# EAGLE schematic Max756Breakout (EAGLE 6.3)
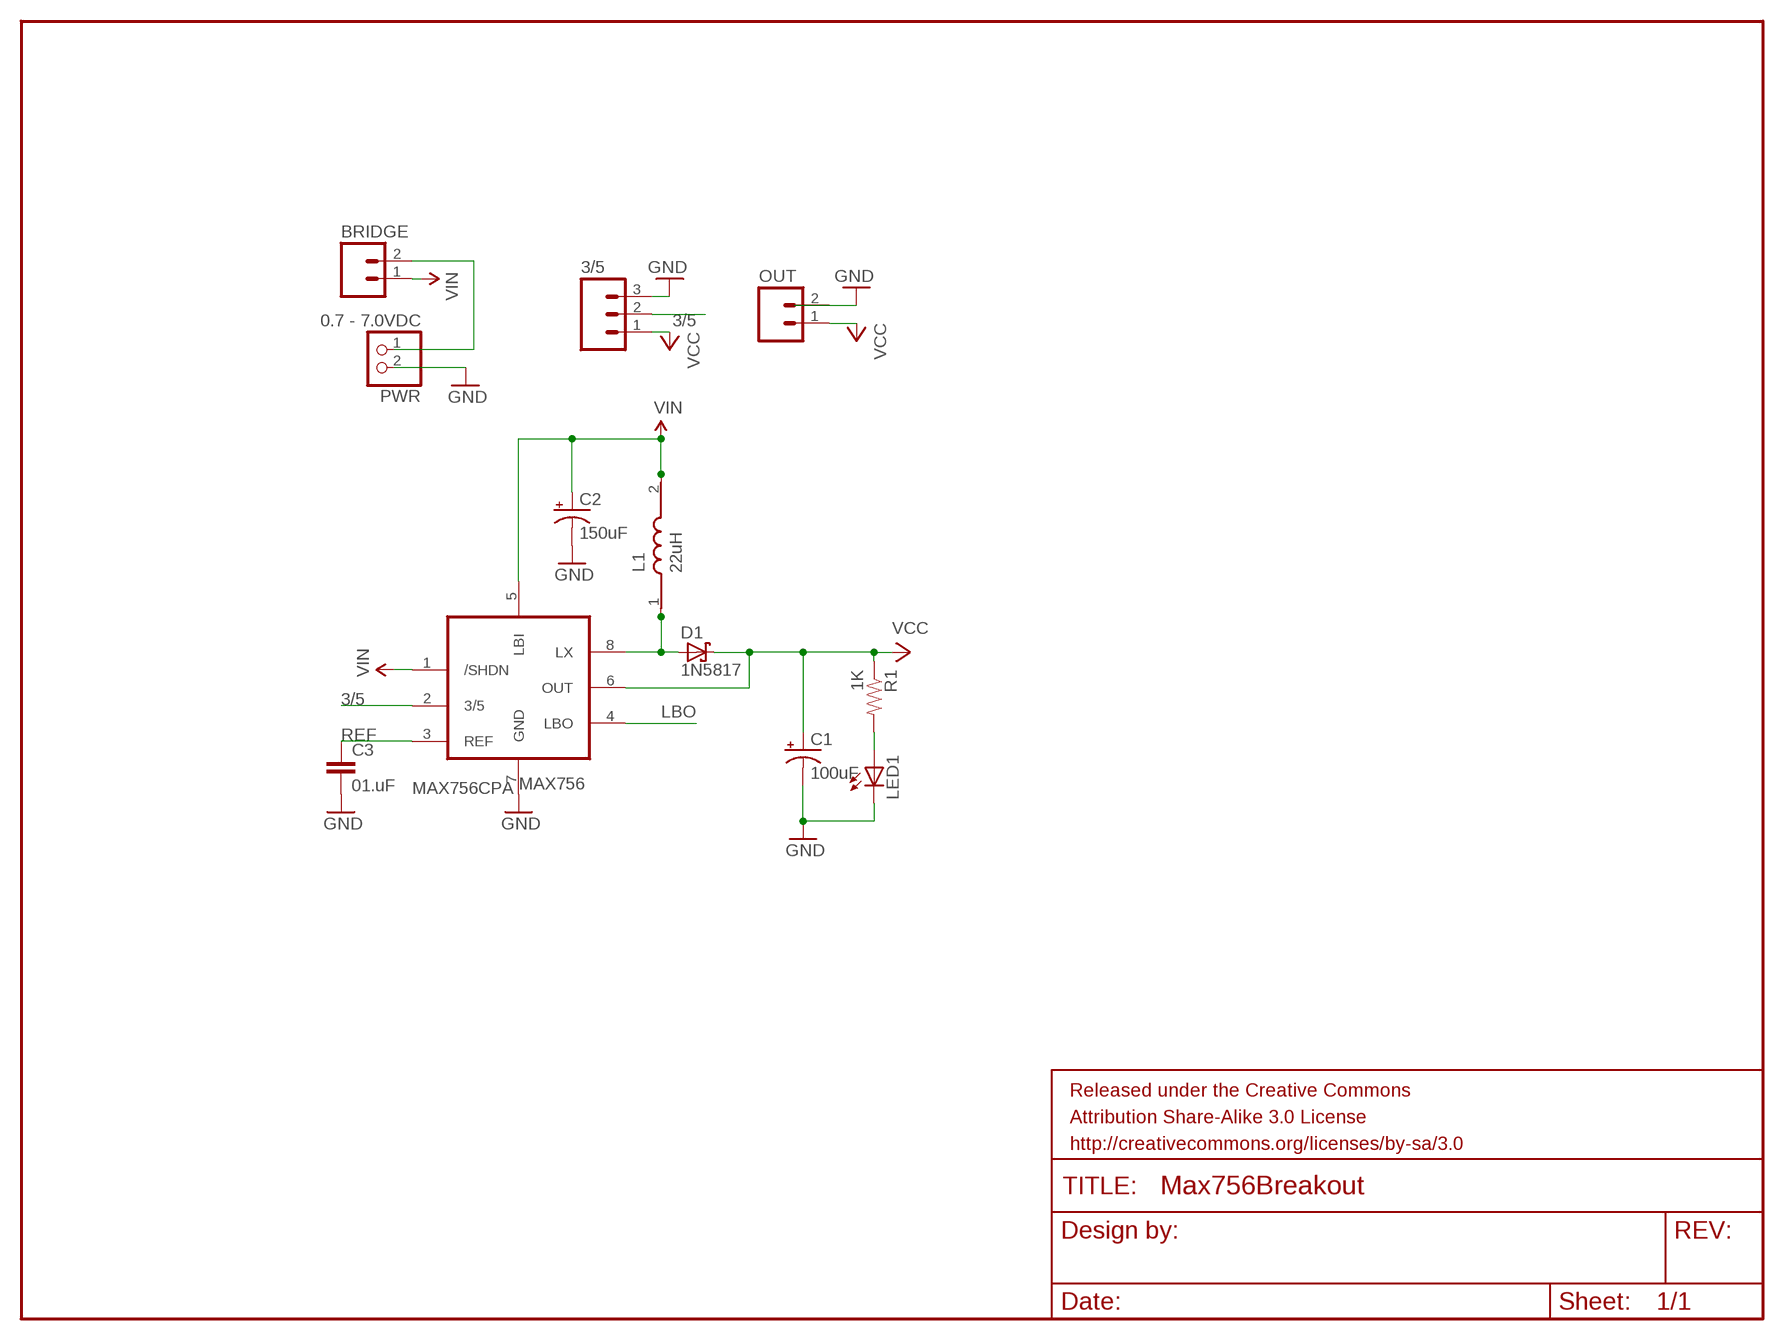
[diagram p0: schematic, sheet 1]

## Parts
3/5  M03LOCK  [1X03_LOCK]
BRIDGE  M02LOCK  [1X02_LOCK]
C1  100uF  CAP_POLPTH2  [CPOL-RADIAL-10UF-25V]
C2  150uF  CAP_POLPTH2  [CPOL-RADIAL-10UF-25V]
C3  01.uF  CAPPTH2  [CAP-PTH-SMALL2]
D1  1N5817  SCHOTTKY-DIODEF126Z12  [F126Z12]
FRAME1  FRAME-LETTER  [CREATIVE_COMMONS]
L1  22uH  82114R  [82114R]
LED1  LED3MM  [LED3MM]
MAX756  MAX756CPA  [DIL08]
OUT  M02LOCK  [1X02_LOCK]
PWR  0.7 - 7.0VDC  JST_2PIN-THM-RA  [JST-PH-2-THM-RA]
R1  1K  RESISTORAXIAL-0.2  [AXIAL-0.2]

## Nets
3/5: 3/5.2 MAX756.2(3/5)
GND [power]: 3/5.3 C1.2(-) C2.2(-) C3.2 LED1.K(C) MAX756.7(GND) OUT.2 PWR.2
L1: D1.A L1.1 MAX756.8(LX)
LBO: MAX756.4(LBO)
N$1 [power]: BRIDGE.2 PWR.1
N$2: LED1.A R1.P$2
REF: C3.1 MAX756.3(REF)
VCC [power]: 3/5.1 C1.1(+) D1.C MAX756.6(OUT) OUT.1 R1.P$1
VIN [power]: BRIDGE.1 C2.1(+) L1.2 MAX756.1(/SHDN) MAX756.5(LBI)

## Library data of the parts
3/5 = SparkFun-Connectors:M03: Header 3 Standard 3-pin 0.1" header. Use with straight break away headers (SKU : PRT-00116), right angle break away headers (PRT-00553), swiss pins (PRT-00743), machine pins (PRT-00117), and female headers (PRT-00115). Molex polarized connector foot print use with SKU : PRT-08232 with associated crimp pins and housings.
BRIDGE OUT = SparkFun-Connectors:M02: Header 2 Standard 2-pin 0.1" header. Use with straight break away headers (SKU : PRT-00116), right angle break away headers (PRT-00553), swiss pins (PRT-00743), machine pins (PRT-00117), and female headers (PRT-00115). Molex polarized connector foot print use with SKU : PRT-08233 with associated crimp pins and housings.
C1 C2 = SparkFun-Capacitors:CAP_POL: Capacitor Polarized These are standard SMD and PTH capacitors. Normally 10uF, 47uF, and 100uF in electrolytic and tantalum varieties. Always verify the external diameter of the through hole cap, it varies with capacity, voltage, and manufacturer. The EIA devices should be standard.
C3 = Dek:CAP: Capacitor Standard 0603 ceramic capacitor, and 0.1" leaded capacitor.
D1 = Dek:SCHOTTKY-DIODE: Schottky Diode
FRAME1 = SparkFun-Aesthetics:FRAME-LETTER: Schematic Frame Standard 8.5x11 US Letter frame
L1 = Dek:82114R: INDUCTOR
LED1 = Dek:LED: LEDs Standard schematic elements and footprints for 5mm, 3mm, 1206, and 0603 sized LEDs. 5mm - Spark Fun Electronics SKU : COM-00529 (and others)
MAX756 = adafruit:MAX756
PWR = Dek:JST_2PIN: JST 2-Pin Connectors of various flavors SMT-RA (S2B-PH-SM4) 4UConnector #17311 SMT (B2B-PH-SM4) THM-RA (S2B-PH) THM (B2B-PH)
R1 = Dek:RESISTOR: Resistor Basic schematic elements and footprints for 0603, 1206, and PTH resistors.

## Net classes
1 power: width 0.305 mm, clearance 0.305 mm